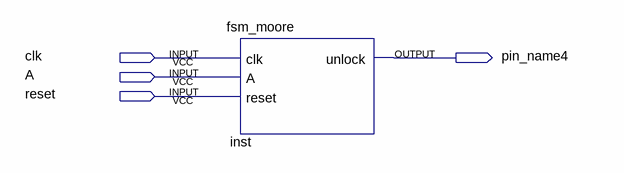
[diagram p0: schematic sheet]
// Quartus schematic moore.bdf as structural Verilog: 1 symbols, 4 pins
module moore (
  input  clk,
  input  A,
  input  reset,
  output pin_name4
);

  fsm_moore inst (.clk(clk), .A(A), .reset(reset), .unlock(pin_name4));
endmodule
